# Altium project Filtro-FT.PrjPcb
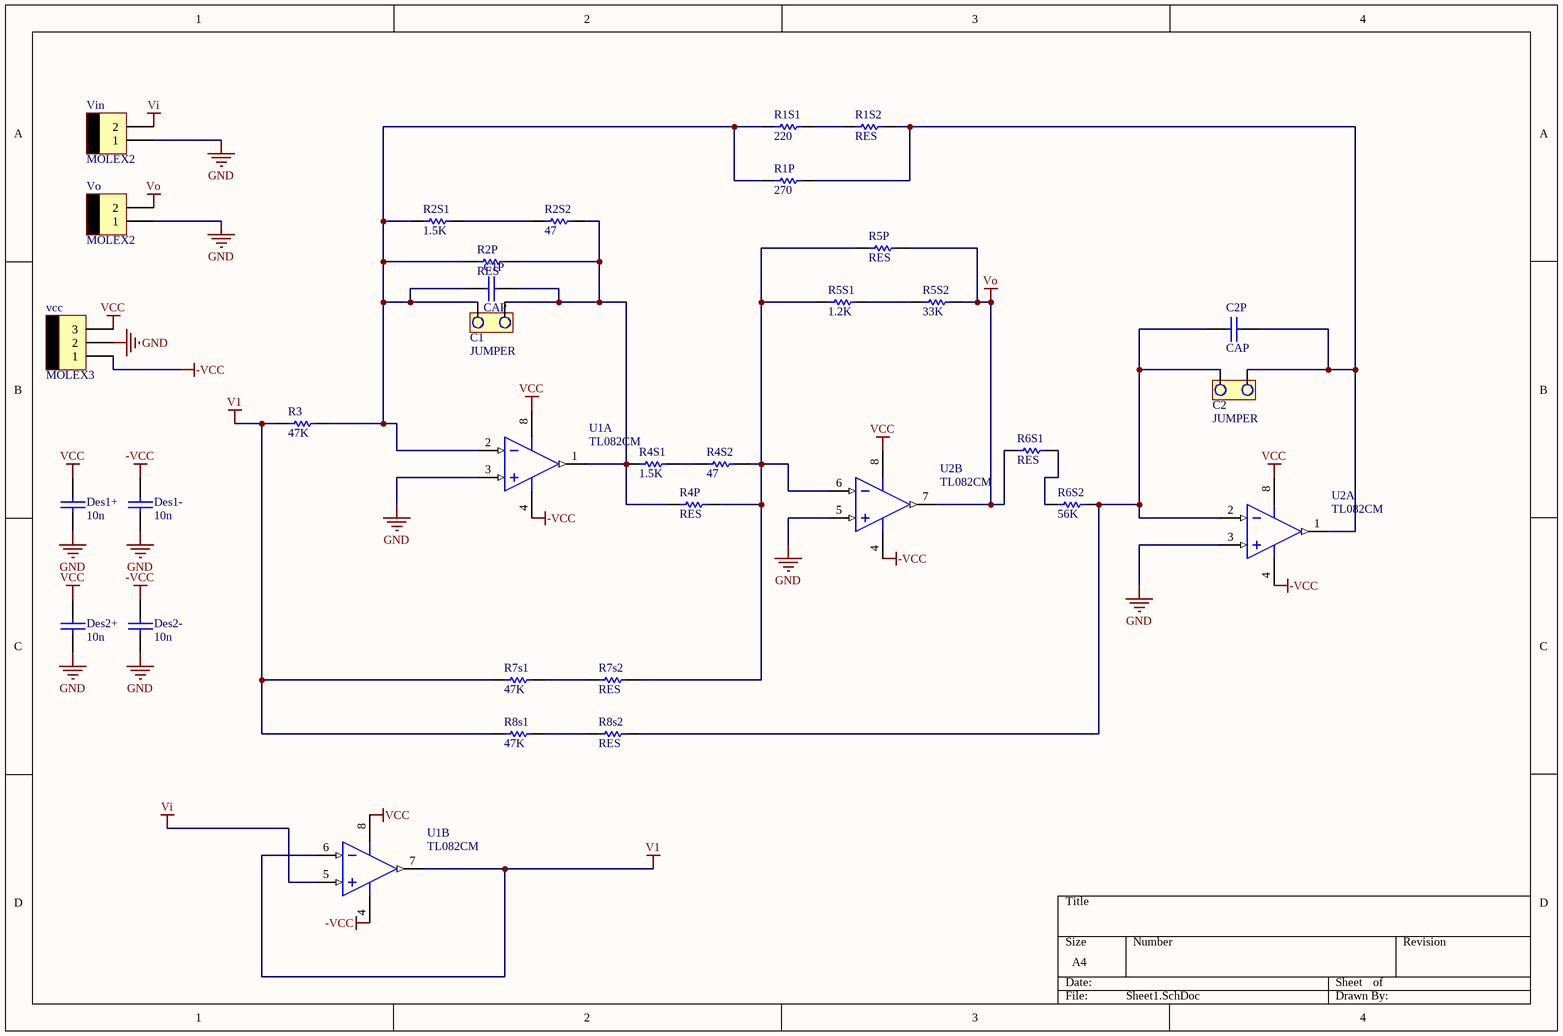
[diagram p0: Sheet1.SchDoc]
1 sheet, 32 parts. Net scope: global (net labels, ports and power ports of the same name join across sheets).
Board file: PCB1.PcbDoc

## Sheet Sheet1.SchDoc
size A4

### Parts
C1  JUMPER  [JUMPER2]
C1P  CAP  [0805]
C2  JUMPER  [JUMPER2]
C2P  CAP  [0805]
Des1+  10n  [0805]
Des1-  10n  [0805]
Des2+  10n  [0805]
Des2-  10n  [0805]
R1P  270  [0805]
R1S1  220  [0805]
R1S2  RES  [0805]
R2P  RES  [0805]
R2S1  1.5K  [0805]
R2S2  47  [0805]
R3  47K  [0805]
R4P  RES  [0805]
R4S1  1.5K  [0805]
R4S2  47  [0805]
R5P  RES  [0805]
R5S1  1.2K  [0805]
R5S2  33K  [0805]
R6S1  RES  [0805]
R6S2  56K  [0805]
R7s1  47K  [0805]
R7s2  RES  [0805]
R8s1  47K  [0805]
R8s2  RES  [0805]
U1  TL082CM  [M08A_N]  (parts A,B of 2)
U2  TL082CM  [M08A_N]  (parts A,B of 2)
vcc  MOLEX3  [MOLEX3]
Vin  MOLEX2  [MOLEX2]
Vo  MOLEX2  [MOLEX2]

### Nets
-VCC: Des1-.1 Des2-.1 U1.4(V-) U2.4(V-) vcc.1
GND: Des1+.2 Des1-.2 Des2+.2 Des2-.2 U1.3(INA+) U2.3(INA+) U2.5(INB+) vcc.2 Vin.1 Vo.1
V1: R3.1 R7s1.1 R8s1.1 U1.6(INB-) U1.7(OUTB)
VCC: Des1+.1 Des2+.1 U1.8(V+) U2.8(V+) vcc.3
Vi: U1.5(INB+) Vin.2
Vo: R5P.2 R5S2.2 R6S1.1 U2.7(OUTB) Vo.2
NetC1_1: C1.1 C1P.1 R1P.1 R1S1.1 R2P.1 R2S1.1 R3.2 U1.2(INA-)
NetC1_2: C1.2 C1P.2 R2P.2 R2S2.2 R4P.1 R4S1.1 U1.1(OUTA)
NetC2_1: C2.1 C2P.1 R6S2.2 R8s2.2 U2.2(INA-)
NetC2_2: C2.2 C2P.2 R1P.2 R1S2.2 U2.1(OUTA)
NetR1S1_2: R1S1.2 R1S2.1
NetR2S1_2: R2S1.2 R2S2.1
NetR4P_2: R4P.2 R4S2.2 R5P.1 R5S1.1 R7s2.2 U2.6(INB-)
NetR4S1_2: R4S1.2 R4S2.1
NetR5S1_2: R5S1.2 R5S2.1
NetR6S1_2: R6S1.2 R6S2.1
NetR7s1_2: R7s1.2 R7s2.1
NetR8s1_2: R8s1.2 R8s2.1

### Library data of the parts
Des1+ Des1- Des2+ Des2- = CAP
R1P R1S1 R2S1 R2S2 R3 R4S1 R4S2 R5S1 R5S2 R6S2 R7s1 R8s1 = RES
U1 U2 = TL082CM: Wide Bandwidth Dual JFET Input Operational Amplifier, 8-pin Narrow SOIC; Manufacturer: National Semiconductor; PackageTopMarking: NSZXTT*TL*082CM; PowerWise: N; CompType: Amplifiers; Published: 4-Dec-2008; LatestRevisionDate: 13-Jan-2009; LatestRevisionNote: Sim Model Added.; DatasheetVersion: Aug-2000; PackageVersion: revM, May-2009; PackageReference: M08A; Publisher: Altium Limited; PackageDescription: SOIC Narrow, 4.9 x 3.9 x 1.45mm, 8 Lead, 1.27mm Pitch; Supplier 1: Digi-Key; Supplier Part Number 1: TL082CM-ND; PartNumber: TL082CM; RoHS: N; PinCount: 8; Code_JEDEC: MS-012-AA; Code_IPC: SOIC127P600-8; ComponentLink1Description: TL082 Datasheet; ComponentLink1URL: http://www.national.com/ds/TL/TL082.pdf; ComponentLink2Description: TL082 Web Page; ComponentLink2URL: http://www.national.com/pf/TL/TL082.html; ComponentLink3Description: M08A Package Page; ComponentLink3URL: http://www.national.com/packaging/folders/m08a.html